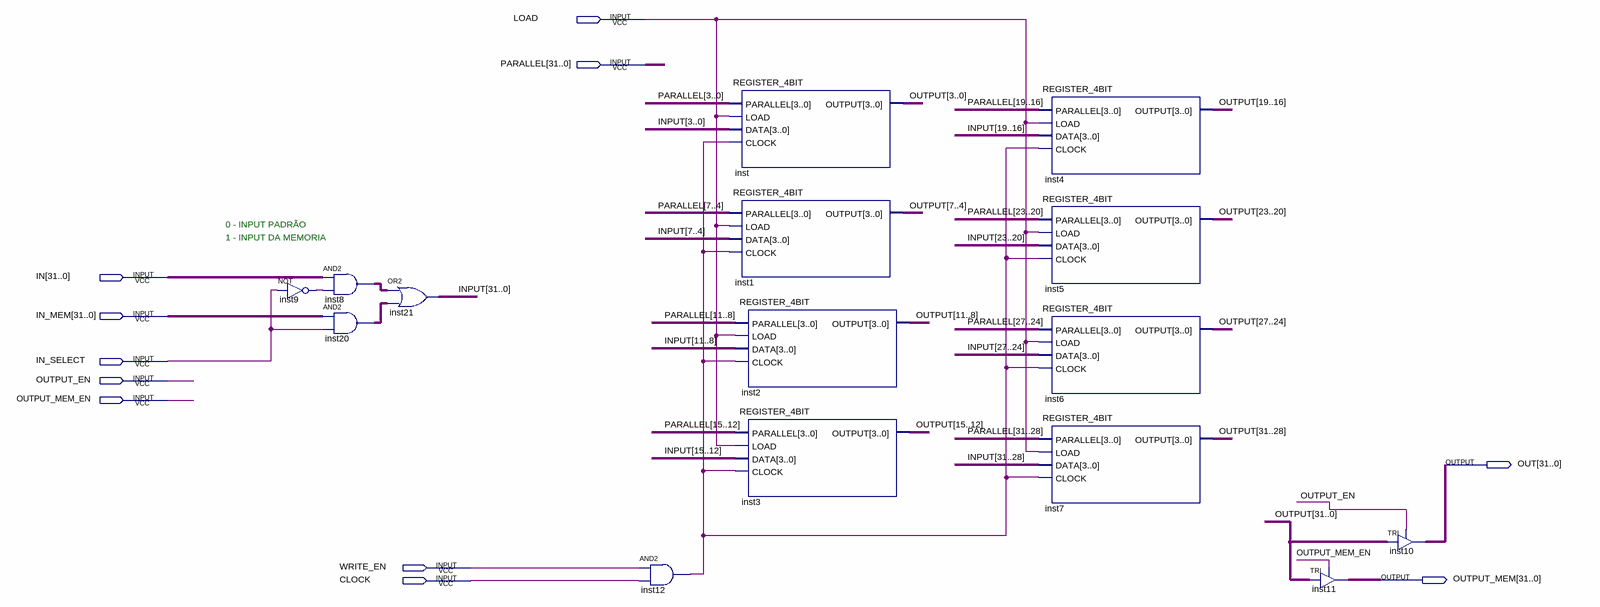
[diagram p0: schematic sheet]
// Quartus schematic REGISTER_32BIT.bdf as structural Verilog: 15 symbols, 11 pins
module REGISTER_32BIT (
  input  LOAD,
  input  [31:0] PARALLEL,
  input  [31:0] IN,
  input  [31:0] IN_MEM,
  input  IN_SELECT,
  input  OUTPUT_EN,
  input  OUTPUT_MEM_EN,
  input  WRITE_EN,
  input  CLOCK,
  output [31:0] OUT,
  output [31:0] OUTPUT_MEM
);

  wire inst9_out, inst12_out;
  wire [31:0] INPUT, inst8_out, inst20_out, OUTPUT;

  not inst9 (inst9_out, IN_SELECT);
  assign inst8_out = IN & {32{inst9_out}};  // AND2 inst8, 32 bits wide
  assign inst20_out = IN_MEM & {32{IN_SELECT}};  // AND2 inst20, 32 bits wide
  assign INPUT = inst8_out | inst20_out;  // OR2 inst21, 32 bits wide
  and inst12 (inst12_out, WRITE_EN, CLOCK);
  REGISTER_4BIT inst (
    .PARALLEL(PARALLEL[3:0]), .LOAD(LOAD), .DATA(INPUT[3:0]), .CLOCK(inst12_out), .OUTPUT(OUTPUT[3:0]));
  REGISTER_4BIT inst1 (
    .PARALLEL(PARALLEL[7:4]), .LOAD(LOAD), .DATA(INPUT[7:4]), .CLOCK(inst12_out), .OUTPUT(OUTPUT[7:4]));
  REGISTER_4BIT inst2 (
    .PARALLEL(PARALLEL[11:8]), .LOAD(LOAD), .DATA(INPUT[11:8]), .CLOCK(inst12_out), .OUTPUT(OUTPUT[11:8]));
  REGISTER_4BIT inst3 (
    .PARALLEL(PARALLEL[15:12]), .LOAD(LOAD), .DATA(INPUT[15:12]), .CLOCK(inst12_out), .OUTPUT(OUTPUT[15:12]));
  REGISTER_4BIT inst4 (
    .PARALLEL(PARALLEL[19:16]), .LOAD(LOAD), .DATA(INPUT[19:16]), .CLOCK(inst12_out), .OUTPUT(OUTPUT[19:16]));
  REGISTER_4BIT inst5 (
    .PARALLEL(PARALLEL[23:20]), .LOAD(LOAD), .DATA(INPUT[23:20]), .CLOCK(inst12_out), .OUTPUT(OUTPUT[23:20]));
  REGISTER_4BIT inst6 (
    .PARALLEL(PARALLEL[27:24]), .LOAD(LOAD), .DATA(INPUT[27:24]), .CLOCK(inst12_out), .OUTPUT(OUTPUT[27:24]));
  REGISTER_4BIT inst7 (
    .PARALLEL(PARALLEL[31:28]), .LOAD(LOAD), .DATA(INPUT[31:28]), .CLOCK(inst12_out), .OUTPUT(OUTPUT[31:28]));
  TRI inst11[31:0] (.IN(OUTPUT), .OE(OUTPUT_MEM_EN), .OUT(OUTPUT_MEM));
  TRI inst10[31:0] (.IN(OUTPUT), .OE(OUTPUT_EN), .OUT(OUT));

  // Notes on the sheet:
  //   0 - INPUT PADRÃO
  //   1 - INPUT DA MEMORIA
endmodule
